# EAGLE schematic controller_V1 (EAGLE 9.6.2)

## Sheet 1 of 2
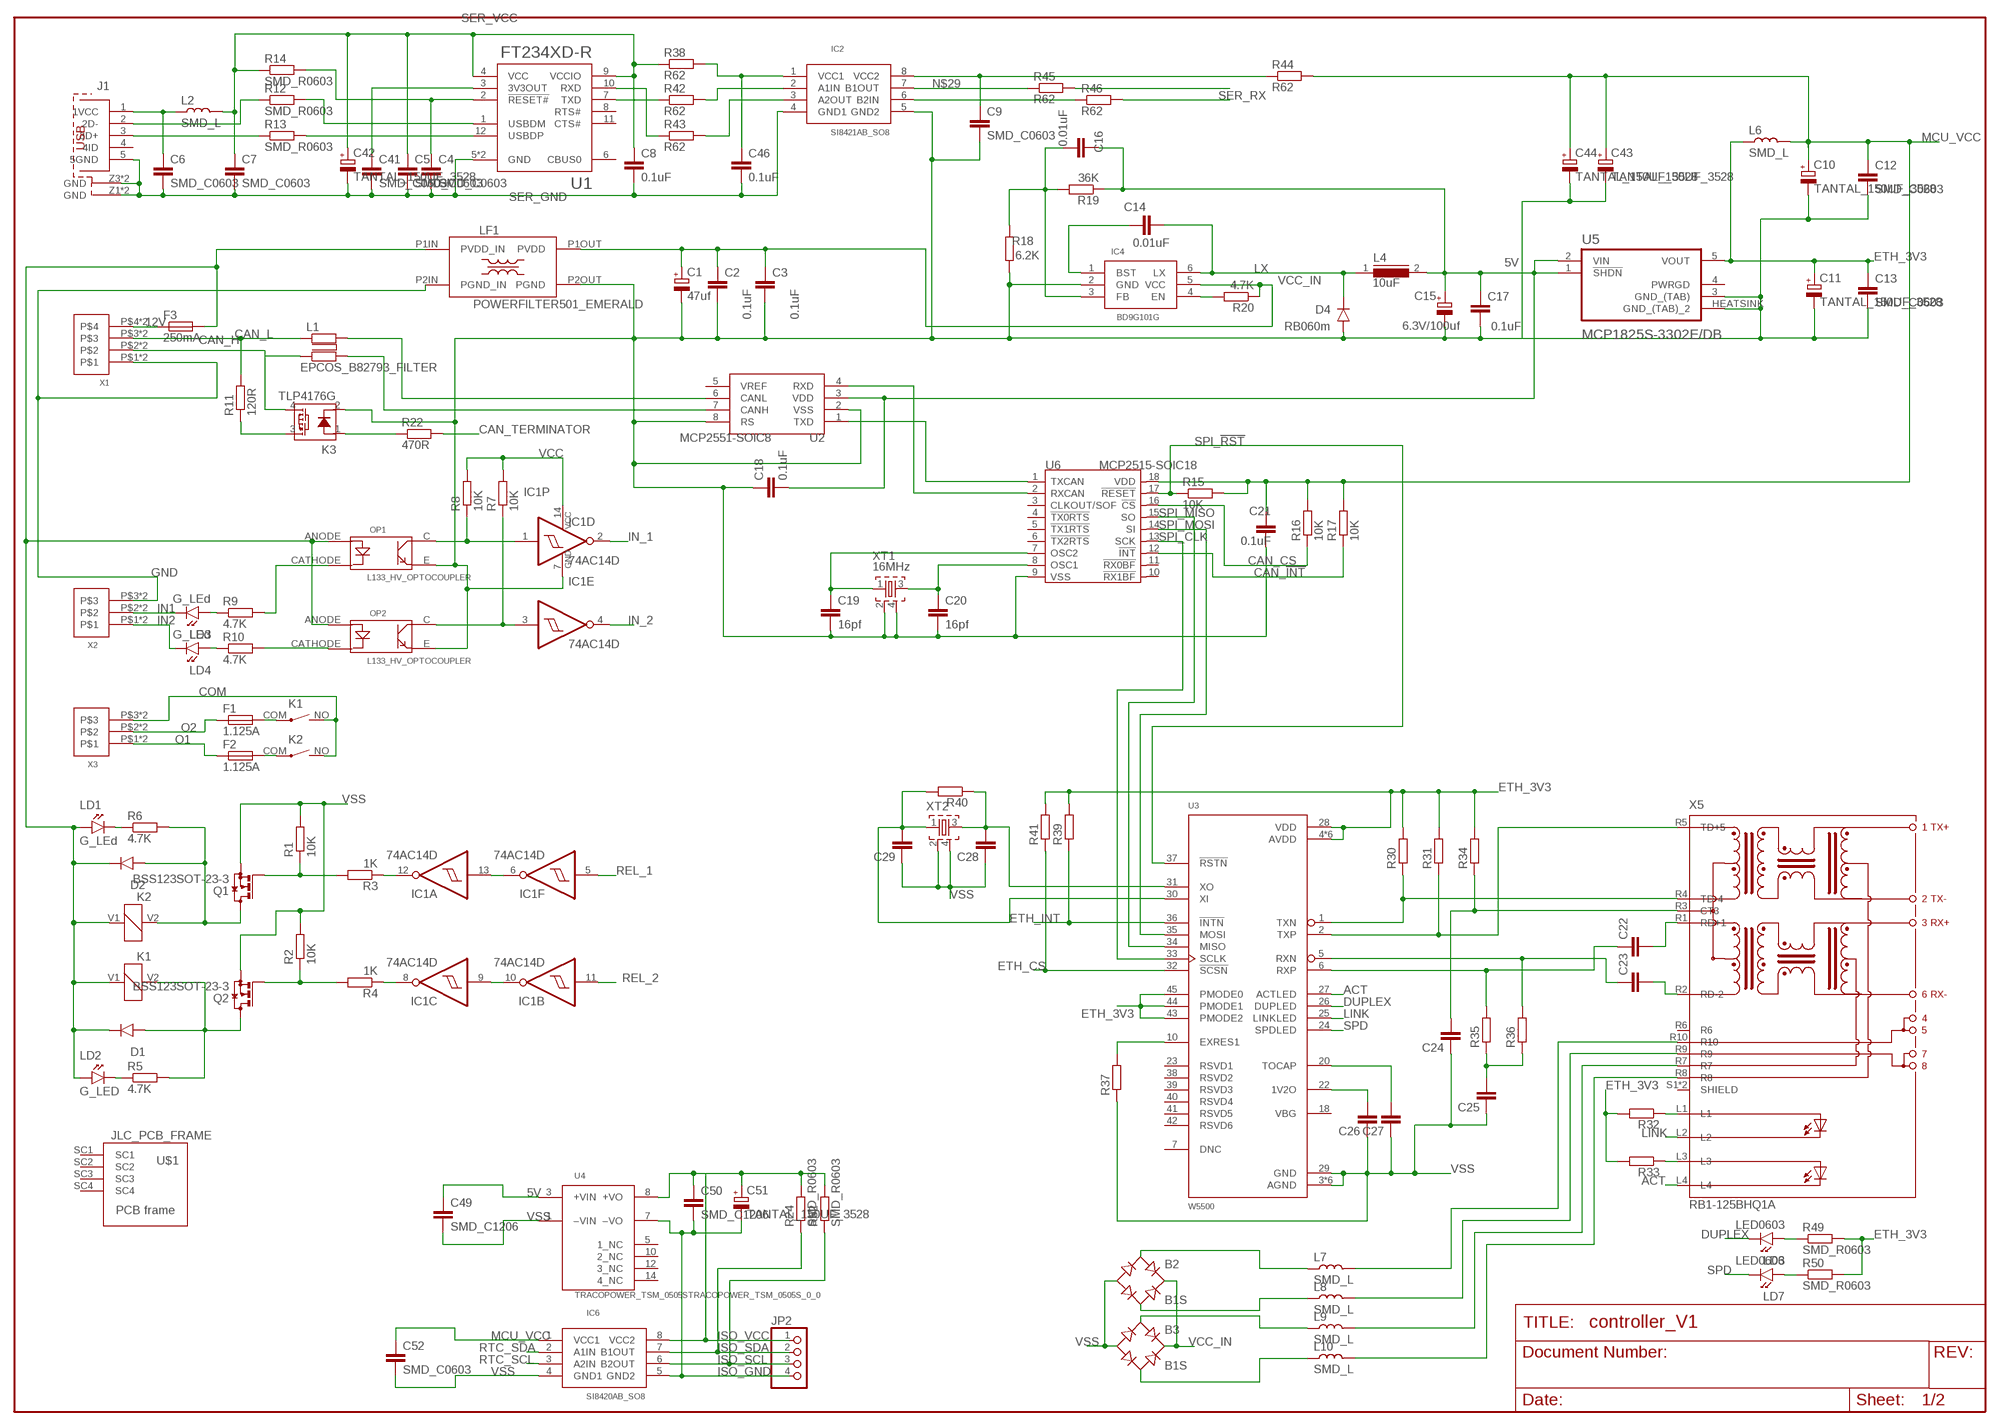
[diagram p0: schematic, sheet 1]

### Parts
B2  B1S  [MBS]
B3  B1S  [MBS]
C1  47uf  RADIAL_470UF_35V_10MM  [5.08MM]
C2  0.1uF  SMD_C1206  [1206]
C3  0.1uF  SMD_C1206  [1206]
C4  SMD_C0603  [0603]
C5  SMD_C0603  [0603]
C6  SMD_C0603  [0603]
C7  SMD_C0603  [0603]
C8  0.1uF  SMD_C0603  [0603]
C9  SMD_C0603  [0603]
C10  TANTAL_150UF_3528  [KA-3528ASYC]
C11  TANTAL_150UF_3528  [KA-3528ASYC]
C12  SMD_C0603  [0603]
C13  SMD_C0603  [0603]
C14  0.01uF  SMD_C0603  [0603]
C15  6.3V/100uf  TANTAL_686_7343  [D/7343-31R]
C16  0.01uF  SMD_C0603  [0603]
C17  0.1uF  SMD_C0603  [0603]
C18  0.1uF  SMD_C0603  [0603]
C19  16pf  SMD_C0603  [0603]
C20  16pf  SMD_C0603  [0603]
C21  0.1uF  SMD_C0603  [0603]
C22  SMD_C0603  [0603]
C23  SMD_C0603  [0603]
C24  0.1uf  SMD_C0603  [0603]
C25  10nf  SMD_C0603  [0603]
C26  SMD_C0603  [0603]
C27  SMD_C0603  [0603]
C28  SMD_C0603  [0603]
C29  SMD_C0603  [0603]
C41  SMD_C0603  [0603]
C42  TANTAL_150UF_3528  [KA-3528ASYC]
C43  TANTAL_150UF_3528  [KA-3528ASYC]
C44  TANTAL_150UF_3528  [KA-3528ASYC]
C46  0.1uF  SMD_C0603  [0603]
C49  SMD_C1206  [1206]
C50  SMD_C1206  [1206]
C51  TANTAL_150UF_3528  [KA-3528ASYC]
C52  SMD_C0603  [0603]
D1  D_MBRA340G  [SMA403D]
D2  D_MBRA340G  [SMA403D]
D4  RB060m  D_MBRA340G  [SMA403D]
F1  1.125A  FUSE  [FUSE_DIP_2.5A250V]
F2  1.125A  FUSE  [FUSE_DIP_2.5A250V]
F3  250mA  SMD_FUSE  [SMD_2410_FUSE_NOK]
IC1  74AC14D  [SO14]
IC2  SI8421AB_SO8  [SO8]
IC4  BD9G101G  BD9G101G_SOT23(6)  [SOT-23(6)]
IC6  SI8420AB_SO8  [SO8]
J1  MINI_USB_TYP_B_@  [65100516121]
JP2  PINHD-1X4  [1X04]
K1  12-H1(610)  [12-H1(610)_DIP]
K2  12-H1(610)  [12-H1(610)_DIP]
K3  TLP4176G  [SOP04]
L1  EPCOS_B82793_FILTER  [EPCOS_FILTER]
L2  SMD_L  [0805]
L4  10uF  DR74  [DR74]
L6  SMD_L  [0805]
L7  SMD_L  [0805]
L8  SMD_L  [0805]
L9  SMD_L  [0805]
L10  SMD_L  [0805]
LD1  G_LEd  LED  [3MM_DIP_LED]
LD2  G_LED  LED  [3MM_DIP_LED]
LD3  G_LEd  LED  [3MM_DIP_LED]
LD4  G_LEd  LED  [3MM_DIP_LED]
LD6  LED0603  [0603_P]
LD7  LED0603  [0603_P]
LF1  POWERFILTER501_EMERALD  [POWERFILTER]
OP1  L133_HV_OPTOCOUPLER  [HV_OPTOCOUPLER_L133]
OP2  L133_HV_OPTOCOUPLER  [HV_OPTOCOUPLER_L133]
Q1  BSS123SOT-23-3  [SOT-23(3)]
Q2  BSS123SOT-23-3  [SOT-23(3)]
R1  10K  SMD_R0603  [0603]
R2  10K  SMD_R0603  [0603]
R3  1K  SMD_R0603  [0603]
R4  1K  SMD_R0603  [0603]
R5  4.7K  SMD_R0603  [0603]
R6  4.7K  SMD_R0603  [0603]
R7  10K  SMD_R0603  [0603]
R8  10K  SMD_R0603  [0603]
R9  4.7K  SMD_R0603  [0603]
R10  4.7K  SMD_R0603  [0603]
R11  120R  R-EU_VMTA55  [VMTA55]
R12  SMD_R0603  [0603]
R13  SMD_R0603  [0603]
R14  SMD_R0603  [0603]
R15  10K  SMD_R0603  [0603]
R16  10K  SMD_R0603  [0603]
R17  10K  SMD_R0603  [0603]
R18  6.2K  SMD_R0603  [0603]
R19  36K  SMD_R0603  [0603]
R20  4.7K  SMD_R0603  [0603]
R22  470R  SMD_R0603  [0603]
R24  SMD_R0603  [0603]
R30  SMD_R0603  [0603]
R31  SMD_R0603  [0603]
R32  SMD_R0603  [0603]
R33  SMD_R0603  [0603]
R34  SMD_R0603  [0603]
R35  SMD_R0603  [0603]
R36  SMD_R0603  [0603]
R37  SMD_R0603  [0603]
R38  R62  SMD_R0603  [0603]
R39  SMD_R0603  [0603]
R40  SMD_R0603  [0603]
R41  SMD_R0603  [0603]
R42  R62  SMD_R0603  [0603]
R43  R62  SMD_R0603  [0603]
R44  R62  SMD_R0603  [0603]
R45  R62  SMD_R0603  [0603]
R46  R62  SMD_R0603  [0603]
R49  SMD_R0603  [0603]
R50  SMD_R0603  [0603]
R52  SMD_R0603  [0603]
U1  FT234XD-R  [IC_FT234XD-R]
U2  MCP2551-SOIC8  [SO8]
U3  W5500  [QFP50P900X900X160-48N]
U4  TRACOPOWER_TSM_0505STRACOPOWER_TSM_0505S_0_0  [TRACOPOWER_TSM_0505S_0]
U5  MCP1825S-3302E/DB  [SOT230P700X180-4N]
U6  MCP2515-SOIC18  [SO18L]
U$1  JLC_PCB_FRAME  [80X100_PCB_FRAME]
X1  WAGO250_X4  [WAGO250_FP_4X]
X2  WAGO250_X3  [WAGO250_FP_3X]
X3  WAGO250_X3  [WAGO250_FP_3X]
X5  RB1-125BHQ1A  [RB1-125BHQ1A]
XT1  16MHz  QUARTZ_ZQ  [QUARTZ_3X3MM]
XT2  QUARTZ_ZQ  [QUARTZ_3X3MM]

### Nets
5V: C15.+ C16.2 C17.2 C18.2 C49.1 L4.2 R19.1 U2.3(VDD) U4.3(+VIN) U5.1(!SHDN) U5.2(VIN)
12V: F3.P$1 X1.P$4 X1.U$4
ACT: U3.27(ACTLED) X5.L4
CAN_!INT: R17.1 U6.12(!INT) ; also sheet 2
CAN_CS: R16.1 U6.16(!CS) ; also sheet 2
CAN_H: K3.4(DS2) L1.P$2 X1.P$2 X1.U$2
CAN_L: L1.P$1 R11.2 X1.P$3 X1.U$3
CAN_TERMINATOR: R22.2 ; also sheet 2
COM: K1.NO(S) K2.NO(S) X3.P$3 X3.U$3
DUPLEX: LD6.1(K) U3.26(DUPLED)
ETH_3V3: C11.P(+) C13.1 L6.1 R30.2 R31.2 R32.2 R33.2 R34.2 R39.2 R41.2 R49.2 R50.2 U3.4(AVDD) U3.8(AVDD) U3.11(AVDD) U3.15(AVDD) U3.17(AVDD) U3.21(AVDD) U3.28(VDD) U3.43(PMODE2) U3.44(PMODE1) U3.45(PMODE0) U5.5(VOUT)
ETH_CS: R41.1 U3.32(!SCSN) ; also sheet 2
ETH_INT: R39.1 U3.36(!INTN) ; also sheet 2
GND: LF1.P2IN(PGND_IN) X1.P$1 X1.U$1 X2.P$3 X2.U$3
IN1: LD3.K X2.P$2 X2.U$2
IN2: LD4.K X2.P$1 X2.U$1
IN_1: IC1.2(D:O) ; also sheet 2
IN_2: IC1.4(E:O) ; also sheet 2
ISO_GND: C50.2 C51.M(-) IC6.5(GND2) JP2.4 U4.7(–VO)
ISO_SCL: IC6.6(B2OUT) JP2.3 R52.1
ISO_SDA: IC6.7(B1OUT) JP2.2 R24.1
ISO_VCC: C50.1 C51.P(+) IC6.8(VCC2) JP2.1 R24.2 R52.2 U4.8(+VO)
LINK: U3.25(LINKLED) X5.L2
LX: C14.2 D4.P$1(C) IC4.6(LX) L4.1
MCU_VCC: C10.P(+) C12.1 C21.1 C43.P(+) C44.P(+) C52.1 IC6.1(VCC1) L6.2 R15.2 R16.2 R17.2 R44.2 U6.18(VDD) ; also sheet 2
N$3: IC2.3(A2OUT) R43.2
N$4: F1.P$2 K1.COM(P)
N$5: F2.P$2 K2.COM(P)
N$6: C41.1 U1.3(3V3OUT)
N$7: Q2.1(G) R2.1 R4.2
N$8: D1.P$2(A) K1.V2 Q2.3(D) R5.2
N$9: D2.P$2(A) K2.V2 Q1.3(D) R6.2
N$10: Q1.1(G) R1.1 R3.2
N$11: LD1.K R6.1
N$13: LD2.K R5.1
N$14: IC2.2(A1IN) R42.2
N$15: IC1.9(C:I) IC1.10(B:O)
N$16: IC1.8(C:O) R4.1
N$17: IC1.6(F:O) IC1.13(A:I)
N$18: IC1.12(A:O) R3.1
N$19: IC1.1(D:I) OP1.C(COLLECTOR) R8.1
N$20: IC1.3(E:I) OP2.C(COLLECTOR) R7.1
N$21: L10.2 X5.R8
N$22: C46.1 IC2.1(VCC1) R38.2
N$23: D1.P$1(C) D2.P$1(C) F3.P$2 K1.V1 K2.V1 LD1.A LD2.A LF1.P1IN(PVDD_IN) OP1.ANODE(ANOD) OP2.ANODE(ANOD)
N$24: OP2.CATHODE(CATHOD) R10.2
N$25: OP1.CATHODE(CATHOD) R9.2
N$26: LD3.A R9.1
N$27: LD4.A R10.1
N$28: C9.1 IC2.8(VCC2) R44.1
N$29: IC2.7(B1OUT) R45.1
N$30: IC2.6(B2IN) R46.1
N$31: K3.3(DS1) R11.1
N$32: U2.1(TXD) U6.1(TXCAN)
N$33: J1.3(3D+) R13.1
N$34: U2.4(RXD) U6.2(RXCAN)
N$35: R13.2 U1.12(USBDP)
N$36: R12.2 U1.1(USBDM)
N$37: J1.2(2D-) R12.1
N$38: C4.1 R14.2 U1.2(!RESET#)
N$39: R42.1 U1.7(TXD)
N$40: C6.1 J1.1(1VCC) L2.1
N$41: L9.2 X5.R7
N$42: L8.2 X5.R9
N$43: R43.1 U1.10(RXD)
N$46: L1.P$3 U2.7(CANH)
N$47: L1.P$4 U2.6(CANL)
N$49: C14.1 IC4.1(BST)
N$50: L7.2 X5.R10
N$51: C16.1 IC4.3(FB) R18.2 R19.2
N$52: IC4.4(EN) R20.2
N$53: C19.1 U6.7(OSC2) XT1.1
N$55: K3.1(A) R22.1
N$56: C20.1 U6.8(OSC1) XT1.3
N$57: B2.AC1 L7.1
N$59: B2.AC2 L8.1
N$60: B3.AC1 L9.1
N$61: B3.AC2 L10.1
N$63: LD6.2(A) R49.1
N$64: LD7.2(A) R50.1
N$65: C22.1 R35.2 U3.6(RXP)
N$66: C23.1 R36.2 U3.5(RXN)
N$67: R30.1 U3.1(TXN) X5.R4(TD-4)
N$68: R31.1 U3.2(TXP) X5.R5(TD+5)
N$69: C24.2 R34.1 X5.R3(CT3)
N$70: C25.2 R35.1 R36.1
N$71: C22.2 X5.R1(RD+1)
N$72: C23.2 X5.R2(RD-2)
N$73: R32.1 X5.L1
N$74: R33.1 X5.L3
N$75: C26.2 U3.22(1V2O)
N$76: C27.2 U3.20(TOCAP)
N$77: R37.2 U3.10(EXRES1)
N$78: C29.2 R40.2 U3.30(XI) XT2.1
N$79: C28.2 R40.1 U3.31(XO) XT2.3
O1: F2.P$1 X3.P$1 X3.U$1
O2: F1.P$1 X3.P$2 X3.U$2
REL_1: IC1.5(F:I) ; also sheet 2
REL_2: IC1.11(B:I) ; also sheet 2
RTC_SCL: IC6.3(A2IN) ; also sheet 2
RTC_SDA: IC6.2(A1IN) ; also sheet 2
SER_GND: C4.2 C5.2 C6.2 C7.2 C8.2 C41.2 C42.M(-) C46.2 IC2.4(GND1) J1.5(5GND) J1.Z1(GND) J1.Z2(GND) J1.Z3(GND) J1.Z4(GND) U1.5(GND) U1.13(GND)
SER_RX: R46.2 ; also sheet 2
SER_TX: R45.2 ; also sheet 2
SER_VCC: C5.1 C7.1 C8.1 C42.P(+) L2.2 R14.1 R38.1 U1.4(VCC) U1.9(VCCIO)
SPD: LD7.1(K) U3.24(SPDLED)
SPI_!RST: R15.1 U3.37(!RSTN) U6.17(!RESET) ; also sheet 2
SPI_CLK: U3.33(SCLK) U6.13(SCK) ; also sheet 2
SPI_MISO: U3.34(MISO) U6.15(SO) ; also sheet 2
SPI_MOSI: U3.35(MOSI) U6.14(SI) ; also sheet 2
VCC: IC1.14(P:VCC) R7.2 R8.2 ; also sheet 2
VCC_IN: B2.+ B3.+ C1.P$2(+) C2.1 C3.1 IC4.5(VCC) LF1.P1OUT(PVDD) R20.1
VSS: B2.- B3.- C1.P$1(-) C2.2 C3.2 C9.2 C10.M(-) C11.M(-) C12.2 C13.2 C15.- C17.1 C18.1 C19.2 C20.2 C21.2 C24.1 C25.1 C26.1 C27.1 C28.1 C29.1 C43.M(-) C44.M(-) C49.2 C52.2 D4.P$2(A) IC1.7(P:GND) IC2.5(GND2) IC4.2(GND) IC6.4(GND1) K3.2(K) LF1.P2OUT(PGND) OP1.E(EMITTER) OP2.E(EMITTER) Q1.2(S) Q2.2(S) R1.2 R2.2 R18.1 R37.1 U2.2(VSS) U2.8(RS) U3.3(AGND) U3.9(AGND) U3.14(AGND) U3.16(AGND) U3.19(AGND) U3.29(GND) U3.48(AGND) U4.1(–VIN) U5.3(GND_(TAB)) U5.HEATSINK(GND_(TAB)_2) U6.9(VSS) XT1.2 XT1.4 XT2.2 XT2.4 ; also sheet 2
Unconnected: J1.4(4ID) U1.6(CBUS0) U1.8(RTS#) U1.11(CTS#) U2.5(VREF) U3.7(DNC) U3.18(VBG) U3.23(RSVD1) U3.38(RSVD2) U3.39(RSVD3) U3.40(RSVD4) U3.41(RSVD5) U3.42(RSVD6) U4.5(1_NC) U4.10(2_NC) U4.12(3_NC) U4.14(4_NC) U5.4(PWRGD) U6.3(CLKOUT/SOF) U6.4(!TX0RTS) U6.5(!TX1RTS) U6.6(!TX2RTS) U6.10(!RX1BF) U6.11(!RX0BF) U$1.SC1 U$1.SC2 U$1.SC3 U$1.SC4 X5.R6 X5.S1(SHIELD) X5.S2(SHIELD)

## Sheet 2 of 2
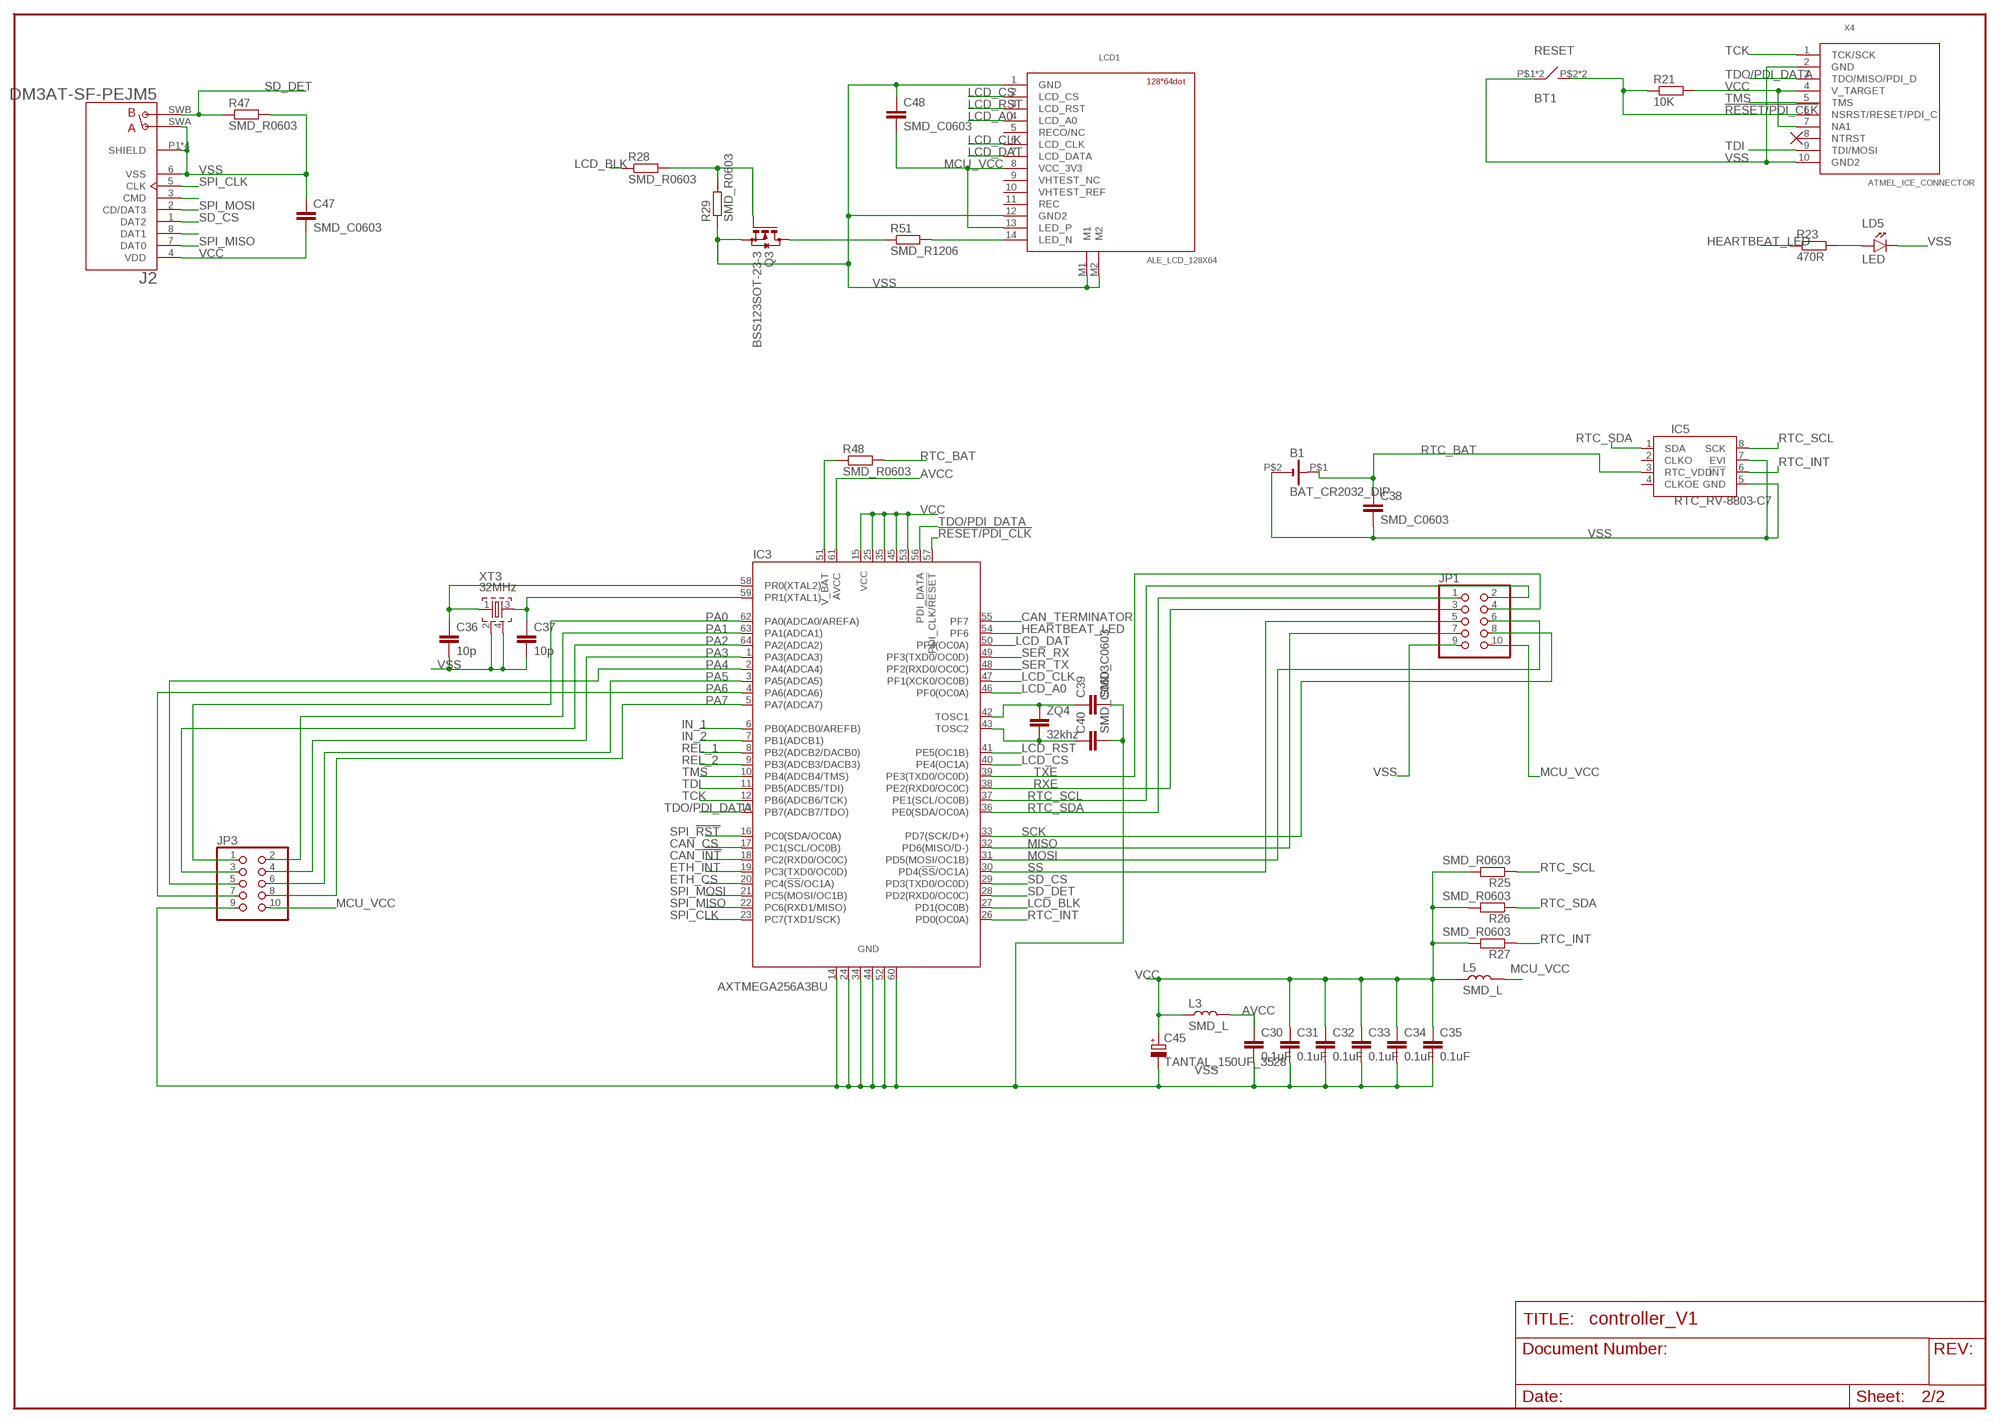
[diagram p1: schematic, sheet 2]

### Parts
B1  BAT_CR2032_DIP  [CR2032_DIP]
BT1  RESET  5X5_TACT_BUTTONCYCLONE  [5X5MM_SMD_CY]
C30  0.1uF  SMD_C0603  [0603]
C31  0.1uF  SMD_C0603  [0603]
C32  0.1uF  SMD_C0603  [0603]
C33  0.1uF  SMD_C0603  [0603]
C34  0.1uF  SMD_C0603  [0603]
C35  0.1uF  SMD_C0603  [0603]
C36  10p  SMD_C0603  [0603]
C37  10p  SMD_C0603  [0603]
C38  SMD_C0603  [0603]
C39  SMD_C0603  [0603]
C40  SMD_C0603  [0603]
C45  TANTAL_150UF_3528  [KA-3528ASYC]
C47  SMD_C0603  [0603]
C48  SMD_C0603  [0603]
IC3  AXTMEGA256A3BU  [TQFP64]
IC5  RTC_RV-8803-C7  [C7_RTC]
J2  DM3AT-SF-PEJM5  [HRS_DM3AT-SF-PEJM5]
JP1  PINHD-2X5  [2X05]
JP3  PINHD-2X5  [2X05]
L3  SMD_L  [0805]
L5  SMD_L  [0805]
LCD1  ALE_LCD_128X64  [ALE_LCD_14PIN_CONNECTOR]
LD5  LED  [3MM_DIP_LED]
Q3  BSS123SOT-23-3  [SOT-23(3)]
R21  10K  SMD_R0603  [0603]
R23  470R  SMD_R0603  [0603]
R25  SMD_R0603  [0603]
R26  SMD_R0603  [0603]
R27  SMD_R0603  [0603]
R28  SMD_R0603  [0603]
R29  SMD_R0603  [0603]
R47  SMD_R0603  [0603]
R48  SMD_R0603  [0603]
R51  SMD_R1206  [1206]
X4  ATMEL_ICE_CONNECTOR  [MINI10P_SPI/JTAG/PDI]
XT3  32MHz  QUARTZ_ZQ  [QUARTZ_3X3MM]
ZQ4  32khz  SMD_C1206  [1206]

### Nets
!RESET/PDI_CLK: BT1.P$2 BT1.P$3 IC3.57(PDI_CLK/!RESET!) R21.1 X4.6(NSRST/RESET/PDI_C)
AVCC: C30.1 IC3.61(AVCC) L3.2
CAN_!INT: IC3.18(PC2(RXD0/OC0C)) ; also sheet 1
CAN_CS: IC3.17(PC1(SCL/OC0B)) ; also sheet 1
CAN_TERMINATOR: IC3.55(PF7) ; also sheet 1
ETH_CS: IC3.20(PC4(!SS!/OC1A)) ; also sheet 1
ETH_INT: IC3.19(PC3(TXD0/OC0D)) ; also sheet 1
HEARTBEAT_LED: IC3.54(PF6) R23.1
IN_1: IC3.6(PB0(ADCB0/AREFB)) ; also sheet 1
IN_2: IC3.7(PB1(ADCB1)) ; also sheet 1
LCD_A0: IC3.46(PF0(OC0A)) LCD1.4(LCD_A0)
LCD_BLK: IC3.27(PD1(OC0B)) R28.1
LCD_CLK: IC3.47(PF1(XCK0/OC0B)) LCD1.6(LCD_CLK)
LCD_CS: IC3.40(PE4(OC1A)) LCD1.2(LCD_CS)
LCD_DAT: IC3.50(PF4(OC0A)) LCD1.7(LCD_DATA)
LCD_RST: IC3.41(PE5(OC1B)) LCD1.3(LCD_RST)
MCU_VCC: C48.2 JP1.10 JP3.10 L5.2 LCD1.8(VCC_3V3) LCD1.13(LED_P) ; also sheet 1
MISO: IC3.32(PD6(MISO/D-)) JP1.7
MOSI: IC3.31(PD5(MOSI/OC1B)) JP1.6
N$12: C36.1 IC3.58(PR0(XTAL2)) XT3.1
N$44: J2.3(CMD)
N$48: C37.1 IC3.59(PR1(XTAL1)) XT3.3
N$54: LD5.A R23.2
N$58: J2.8(DAT1)
N$62: IC3.51(V_BAT) R48.1
N$81: Q3.3(D) R51.1
N$82: LCD1.14(LED_N) R51.2
N$90: C40.1 IC3.43(TOSC2) ZQ4.2
N$91: C39.1 IC3.42(TOSC1) ZQ4.1
N$101: Q3.1(G) R28.2 R29.2
PA0: IC3.62(PA0(ADCA0/AREFA)) JP3.1
PA1: IC3.63(PA1(ADCA1)) JP3.2
PA2: IC3.64(PA2(ADCA2)) JP3.3
PA3: IC3.1(PA3(ADCA3)) JP3.4
PA4: IC3.2(PA4(ADCA4)) JP3.5
PA5: IC3.3(PA5(ADCA5)) JP3.6
PA6: IC3.4(PA6(ADCA6)) JP3.7
PA7: IC3.5(PA7(ADCA7)) JP3.8
REL_1: IC3.8(PB2(ADCB2/DACB0)) ; also sheet 1
REL_2: IC3.9(PB3(ADCB3/DACB3)) ; also sheet 1
RTC_BAT: B1.P$1(+) C38.1 IC5.3(RTC_VDD) R48.2
RTC_INT: IC3.26(PD0(OC0A)) IC5.6(!INT) R27.1
RTC_SCL: IC3.37(PE1(SCL/OC0B)) IC5.8(SCK) JP1.2 R25.1 ; also sheet 1
RTC_SDA: IC3.36(PE0(SDA/OC0A)) IC5.1(SDA) JP1.1 R26.1 ; also sheet 1
RXE: IC3.38(PE2(RXD0/OC0C)) JP1.3
SCK: IC3.33(PD7(SCK/D+)) JP1.8
SD_CS: IC3.29(PD3(TXD0/OC0D)) J2.1(DAT2)
SD_DET: IC3.28(PD2(RXD0/OC0C)) J2.SWB(B) R47.1
SER_RX: IC3.49(PF3(TXD0/OC0D)) ; also sheet 1
SER_TX: IC3.48(PF2(RXD0/OC0C)) ; also sheet 1
SPI_!RST: IC3.16(PC0(SDA/OC0A)) ; also sheet 1
SPI_CLK: IC3.23(PC7(TXD1/SCK)) J2.5(CLK) ; also sheet 1
SPI_MISO: IC3.22(PC6(RXD1/MISO)) J2.7(DAT0) ; also sheet 1
SPI_MOSI: IC3.21(PC5(MOSI/OC1B)) J2.2(CD/DAT3) ; also sheet 1
SS: IC3.30(PD4(!SS!/OC1A)) JP1.5
TCK: IC3.12(PB6(ADCB6/TCK)) X4.1(TCK/SCK)
TDI: IC3.11(PB5(ADCB5/TDI)) X4.9(TDI/MOSI)
TDO/PDI_DATA: IC3.13(PB7(ADCB7/TDO)) IC3.56(PDI_DATA) X4.3(TDO/MISO/PDI_D)
TMS: IC3.10(PB4(ADCB4/TMS)) X4.5(TMS)
TXE: IC3.39(PE3(TXD0/OC0D)) JP1.4
VCC: C31.1 C32.1 C33.1 C34.1 C35.1 C45.P(+) C47.2 IC3.15(VCC1) IC3.25(VCC2) IC3.35(VCC3) IC3.45(VCC4) IC3.53(VCC5) J2.4(VDD) L3.1 L5.1 R21.2 R25.2 R26.2 R27.2 X4.4(V_TARGET) X4.7(NA1) ; also sheet 1
VSS: B1.P$2(-) BT1.P$1 BT1.P$4 C30.2 C31.2 C32.2 C33.2 C34.2 C35.2 C36.2 C37.2 C38.2 C39.2 C40.2 C45.M(-) C47.1 C48.1 IC3.14(GND1) IC3.24(GND2) IC3.34(GND3) IC3.44(GND4) IC3.52(GND5) IC3.60(GND6) IC5.5(GND) IC5.7(EVI) J2.6(VSS) J2.P1(SHIELD) J2.P2(SHIELD) J2.P3(SHIELD) J2.P4(SHIELD) J2.SWA(A) JP1.9 JP3.9 LCD1.1(GND) LCD1.12(GND2) LCD1.M1 LCD1.M2 LD5.K Q3.2(S) R29.1 R47.2 X4.2(GND) X4.10(GND2) XT3.2 XT3.4 ; also sheet 1
Unconnected: IC5.2(CLKO) IC5.4(CLKOE) LCD1.5(RECO/NC) LCD1.9(VHTEST_NC) LCD1.10(VHTEST_REF) LCD1.11(REC) X4.8(NTRST)

## Library data of the parts
B1 = passive_components:BAT_CR2032_DIP
B2 B3 = rectifier:B*S: Surface Mount Glass Passivated Bridge Rectifiers Source: Comchip Bridge Rectifiers B05S-G_B10S-G.pdf
BT1 = passive_components:5X5_TACT_BUTTON
C1 = passive_components:RADIAL_470UF_35V_10MM
C2-C9 C12-C14 C16-C41 C46-C50 C52 ZQ4 = passive_components:SMD_C
C10 C11 C42-C45 C51 = passive_components:TANTAL_150UF_3528
C15 = passive_components:TANTAL_686_7343
D1 D2 D4 = passive_components:D_MBRA340G
F1 F2 = Power:FUSE
F3 = passive_components:SMD_FUSE
IC1 = my_IC:74*14: Hex schmitt trigger INVERTER
IC2 = my_IC:SI8421AB_SO8
IC3 = my_IC:AXTMEGA256A3BU: MICROCONTROLLER Low-voltage (L) 256 Kbytes FLASH 8KBytes boot section 4KBytes EEPROM 16KBytes internal SRAM
IC4 = my_lib:BD9G101G_SOT23(6)
IC5 = my_IC:RTC_RV-8803-C7
IC6 = my_IC:SI8420AB_SO8
J1 = passive_components:MINI_USB_TYP_B_@
J2 = micro_SD_DM3AT-SF-PEJM5:DM3AT-SF-PEJM5: DM3 Series 8 Position Right Angle SMT Push Push Ejection MicroSD Card Connector; AVAILABILITY: Unavailable; DESCRIPTION: 10 (8 + 2) Position Card Connector Secure Digital - microSD™ Surface Mount, Right Angle Gold; MF: Hirose; MP: DM3AT-SF-PEJM5; PACKAGE: None; PRICE: None
JP1 JP3 = pinhead:PINHD-2X5: PIN HEADER
JP2 = pinhead:PINHD-1X4: PIN HEADER
K1 K2 = relays:12-H1(610)
K3 = relays:TLP4176G
L1 = passive_components:EPCOS_B82793_FILTER
L2 L3 L5-L10 = passive_components:SMD_L
L4 = inductors:DR74: High Power Density, High Efficiency, Shielded Inductors Source: coiltronics_dr_series.pdf; SPICEPREFIX: L
LCD1 = passive_components:ALE_LCD_128X64
LD1-LD7 = passive_components:LED
LF1 = Power:POWERFILTER501_EMERALD
OP1 OP2 = passive_components:L133_HV_OPTOCOUPLER
Q1-Q3 = passive_components:BSS123: N-CHANNEL MOS FET
R1-R10 R12-R52 = passive_components:SMD_R
R11 = rcl:R-EU_: RESISTOR, European symbol
U1 = my_IC:FT234XD-R: USB Bridge, USB to UART USB 2.0 UART Interface 12-DFN (3x3); AVAILABILITY: Unavailable; DESCRIPTION: USB Bridge, USB to UART USB 2.0 UART Interface 12-DFN (3x3); MF: FTDI,; MP: FT234XD-R; PACKAGE: DFN-12 FTDI; PRICE: None
U2 = my_IC:MCP2551: High-Speed CAN Transceiver http://ww1.microchip.com/downloads/en/devicedoc/21667f.pdf
U3 = W5500:W5500: Hardwired TCP/IP embedded Ethernet controller Check prices <https://pricing.snapeda.com/search/part/W5500/?ref=eda>; AVAILABILITY: Good; DESCRIPTION: Ethernet Bridge, RS232 to TCP/IP 10/100 Base-T/TX PHY Serial Interface Module; MF: WIZnet; MP: W5500; PACKAGE: LQFP-48 Victor Technologies; PRICE: None; PURCHASE-URL: https://pricing.snapeda.com/search/part/W5500/?ref=eda
U4 = Tracopower - TSM 0505S:TRACOPOWER_TSM_0505S: Isolated Module DC DC Converter 1 Output 5V 200mA 4.5V - 5.5V Input; CENTROID_NOT_SPECIFIED: No; DATASHEET: https://assets.tracopower.com/20181025132111/TSM/documents/tsm-datasheet.pdf; DEVICE_CLASS_L1: Integrated Circuits (ICs); DEVICE_CLASS_L2: Power Management ICs; DEVICE_CLASS_L3: Voltage Regulators - Switching; DIGIKEY_DESCRIPTION: IC DC DC CONVERTER 5V 1W; DIGIKEY_PART_NUMBER: 1951-2748-ND; HEIGHT: 7.3mm; LEAD_FREE: yes; MAX_SUPPLY_VOLTAGE: 5.5V; MF: Tracopower; MFG_PACKAGE_IDENT: TSM; MFG_PACKAGE_IDENT_DATE: 0; MFG_PACKAGE_IDENT_REV: 0; MIN_SUPPLY_VOLTAGE: 4.5V; MOUSER_DESCRIPTION: DC-DC Converter PCB mount; Input 5Vdc; Output 5Vdc at 0.2A; SMD package; 1000 Vdc I/O-isolation; MOUSER_PART_NUMBER: 495-TSM-0505S; MPN: TSM 0505S; NUMBER_OF_OUTPUTS: 1; OUTPUT_CURRENT: 200mA; OUTPUT_VOLTAGE: 5V; PACKAGE: SMD14; PREFIX: U; ROHS: yes; STANDOFF_HEIGHT: 0.25mm; SWITCHING_FREQUENCY: 100kHz; SWITCHING_TOPOLOGY: Other; TEMPERATURE_RANGE_HIGH: +85°C; TEMPERATURE_RANGE_LOW: -40°C; VERIFICATION_VERSION: 0.0.0.1
U5 = my_IC:MCP1825S-3302E/DB; AVAILABILITY: Unavailable; DESCRIPTION: Linear Voltage Regulator IC 1 Output 500mA SOT-223-3; MF: Microchip; MP: MCP1825S-3302E/DB; PACKAGE: SOT-223 Microchip; PRICE: None
U6 = my_IC:MCP2515: Stand-Alone CAN Controller With SPI Interface
U$1 = passive_components:JLC_PCB_FRAME
X1 = Wago_250:WAGO250_X4
X2 X3 = Wago_250:WAGO250_X3
X4 = passive_components:ATMEL_ICE_CONNECTOR
X5 = W5500:RB1-125BHQ1A
XT1-XT3 = passive_components:QUARTZ_ZQ